# Altium schematic sheet HYDRA_V3_NAV.SchDoc
size B; SheetNumber: 1; SheetTotal: 7
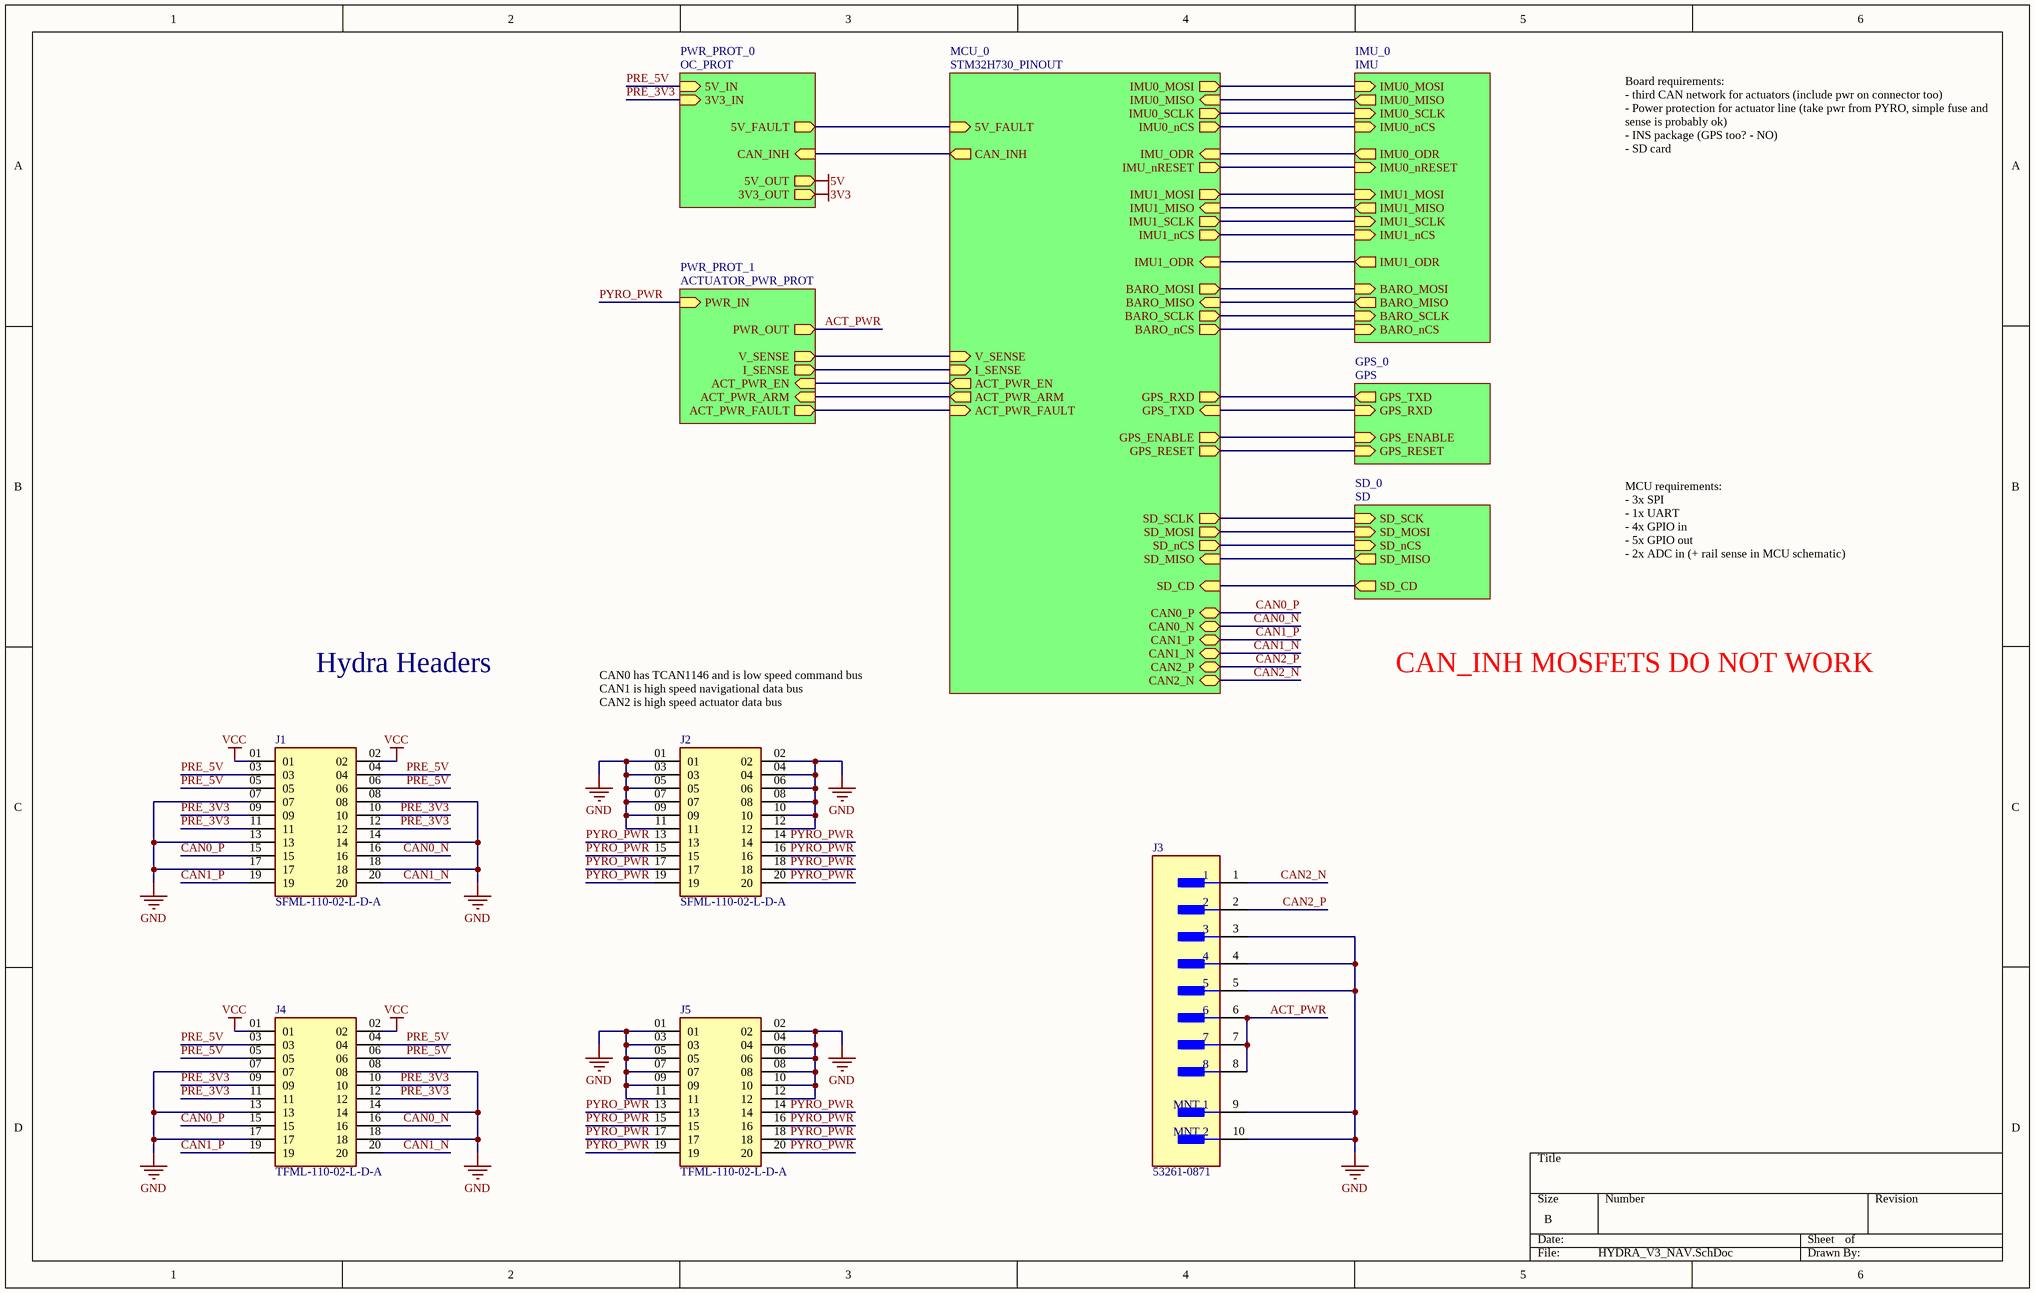
[diagram p0: HYDRA_V3_NAV.SchDoc]

## Parts
J1  SFML-110-02-L-D-A  [SFML-110-02-L-D-A-Footprint-1]
J2  SFML-110-02-L-D-A  [SFML-110-02-L-D-A-Footprint-1]
J3  53261-0871  [FP-532610871-MFG]
J4  TFML-110-02-L-D-A  [TFML-110-02-L-D-A-Footprint-1]
J5  TFML-110-02-L-D-A  [TFML-110-02-L-D-A-Footprint-1]

## Sub-sheets
GPS_0 = GPS: GPS_TXD (out), GPS_RXD (in), GPS_ENABLE (in), GPS_RESET (in)
IMU_0 = IMU: IMU0_MOSI (in), IMU0_MISO (out), IMU0_SCLK (in), IMU0_nCS (in), IMU0_ODR (out), IMU0_nRESET (in), IMU1_MOSI (in), IMU1_MISO (out), IMU1_SCLK (in), IMU1_nCS (in), IMU1_ODR (out), BARO_MOSI (in), BARO_MISO (out), BARO_SCLK (in), BARO_nCS (in)
MCU_0 = STM32H730_PINOUT: IMU_ODR (in), IMU_nRESET (out), BARO_MOSI (out), BARO_MISO (in), BARO_SCLK (out), BARO_nCS (out), V_SENSE (in), I_SENSE (in), 5V_FAULT (in), GPS_RXD (out), GPS_TXD (in), GPS_ENABLE (out), GPS_RESET (out), SD_SCLK (out), SD_MOSI (out), SD_nCS (out), SD_MISO (in), SD_CD (in), CAN0_P (bidir), CAN0_N (bidir), CAN1_P (bidir), CAN1_N (bidir), CAN2_P (bidir), CAN2_N (bidir), IMU1_MOSI (out), IMU1_MISO (in), IMU1_SCLK (out), IMU1_nCS (out), IMU1_ODR (in), CAN_INH (out), ACT_PWR_EN (out), ACT_PWR_ARM (out), ACT_PWR_FAULT (in), IMU0_MOSI (out), IMU0_MISO (in), IMU0_SCLK (out), IMU0_nCS (out)
PWR_PROT_0 = OC_PROT: 5V_OUT (out), 5V_IN (in), 3V3_IN (in), 3V3_OUT (out), 5V_FAULT (out), CAN_INH (in)
PWR_PROT_1 = ACTUATOR_PWR_PROT: PWR_IN (in), PWR_OUT (out), V_SENSE (out), I_SENSE (out), ACT_PWR_EN (in), ACT_PWR_ARM (in), ACT_PWR_FAULT (out)
SD_0 = SD: SD_SCK (in), SD_MOSI (in), SD_nCS (in), SD_MISO (out), SD_CD (out)

## Nets
3V3: sheet PWR_PROT_0/3V3_OUT
5V: sheet PWR_PROT_0/5V_OUT
GND: J1.07 J1.08 J1.13 J1.14 J1.17 J1.18 J2.01 J2.02 J2.03 J2.04 J2.05 J2.06 J2.07 J2.08 J2.09 J2.10 J2.11 J2.12 J3.3 J3.4 J3.5 J3.9(MNT_1) J3.10(MNT_2) J4.07 J4.08 J4.13 J4.14 J4.17 J4.18 J5.01 J5.02 J5.03 J5.04 J5.05 J5.06 J5.07 J5.08 J5.09 J5.10 J5.11 J5.12
VCC: J1.01 J1.02 J4.01 J4.02
ACT_PWR: J3.6 J3.7 J3.8 ; sheet PWR_PROT_1/PWR_OUT
CAN0_N: J1.16 J4.16 ; sheet MCU_0/CAN0_N
CAN0_P: J1.15 J4.15 ; sheet MCU_0/CAN0_P
CAN1_N: J1.20 J4.20 ; sheet MCU_0/CAN1_N
CAN1_P: J1.19 J4.19 ; sheet MCU_0/CAN1_P
CAN2_N: J3.1 ; sheet MCU_0/CAN2_N
CAN2_P: J3.2 ; sheet MCU_0/CAN2_P
PRE_3V3: J1.09 J1.10 J1.11 J1.12 J4.09 J4.10 J4.11 J4.12 ; sheet PWR_PROT_0/3V3_IN
PRE_5V: J1.03 J1.04 J1.05 J1.06 J4.03 J4.04 J4.05 J4.06 ; sheet PWR_PROT_0/5V_IN
PYRO_PWR: J2.13 J2.14 J2.15 J2.16 J2.17 J2.18 J2.19 J2.20 J5.13 J5.14 J5.15 J5.16 J5.17 J5.18 J5.19 J5.20 ; sheet PWR_PROT_1/PWR_IN
(unnamed): sheet MCU_0/IMU_ODR, sheet IMU_0/IMU0_ODR
(unnamed): sheet MCU_0/IMU_nRESET, sheet IMU_0/IMU0_nRESET
(unnamed): sheet MCU_0/BARO_MOSI, sheet IMU_0/BARO_MOSI
(unnamed): sheet MCU_0/BARO_MISO, sheet IMU_0/BARO_MISO
(unnamed): sheet MCU_0/BARO_SCLK, sheet IMU_0/BARO_SCLK
(unnamed): sheet MCU_0/BARO_nCS, sheet IMU_0/BARO_nCS
(unnamed): sheet MCU_0/V_SENSE, sheet PWR_PROT_1/V_SENSE
(unnamed): sheet MCU_0/I_SENSE, sheet PWR_PROT_1/I_SENSE
(unnamed): sheet MCU_0/5V_FAULT, sheet PWR_PROT_0/5V_FAULT
(unnamed): sheet MCU_0/GPS_RXD, sheet GPS_0/GPS_TXD
(unnamed): sheet MCU_0/GPS_TXD, sheet GPS_0/GPS_RXD
(unnamed): sheet MCU_0/GPS_ENABLE, sheet GPS_0/GPS_ENABLE
(unnamed): sheet MCU_0/GPS_RESET, sheet GPS_0/GPS_RESET
(unnamed): sheet MCU_0/SD_SCLK, sheet SD_0/SD_SCK
(unnamed): sheet MCU_0/SD_MOSI, sheet SD_0/SD_MOSI
(unnamed): sheet MCU_0/SD_nCS, sheet SD_0/SD_nCS
(unnamed): sheet MCU_0/SD_MISO, sheet SD_0/SD_MISO
(unnamed): sheet MCU_0/SD_CD, sheet SD_0/SD_CD
(unnamed): sheet MCU_0/IMU1_MOSI, sheet IMU_0/IMU1_MOSI
(unnamed): sheet MCU_0/IMU1_MISO, sheet IMU_0/IMU1_MISO
(unnamed): sheet MCU_0/IMU1_SCLK, sheet IMU_0/IMU1_SCLK
(unnamed): sheet MCU_0/IMU1_nCS, sheet IMU_0/IMU1_nCS
(unnamed): sheet MCU_0/IMU1_ODR, sheet IMU_0/IMU1_ODR
(unnamed): sheet MCU_0/CAN_INH, sheet PWR_PROT_0/CAN_INH
(unnamed): sheet MCU_0/ACT_PWR_EN, sheet PWR_PROT_1/ACT_PWR_EN
(unnamed): sheet MCU_0/ACT_PWR_ARM, sheet PWR_PROT_1/ACT_PWR_ARM
(unnamed): sheet MCU_0/ACT_PWR_FAULT, sheet PWR_PROT_1/ACT_PWR_FAULT
(unnamed): sheet MCU_0/IMU0_MOSI, sheet IMU_0/IMU0_MOSI
(unnamed): sheet MCU_0/IMU0_MISO, sheet IMU_0/IMU0_MISO
(unnamed): sheet MCU_0/IMU0_SCLK, sheet IMU_0/IMU0_SCLK
(unnamed): sheet MCU_0/IMU0_nCS, sheet IMU_0/IMU0_nCS

## Notes on the sheet
- Board requirements:
  - third CAN network for actuators (include pwr on connector too)
  - Power protection for actuator line (take pwr from PYRO, simple fuse and sense is probably ok)
  - INS package (GPS too? - NO)
  - SD card
- MCU requirements:
  - 3x SPI
  - 1x UART
  - 4x GPIO in
  - 5x GPIO out
  - 2x ADC in (+ rail sense in MCU schematic)
- Hydra Headers
- CAN0 has TCAN1146 and is low speed command bus
  CAN1 is high speed navigational data bus
  CAN2 is high speed actuator data bus
- CAN_INH MOSFETS DO NOT WORK

## Library data of the parts
J1 J2 = CMP-002-00043-1: Board Connector, 20 Contact(s), 2 Row(s), Female, Straight, 0.05 inch Pitch, Surface Mount Terminal, Locking, Black Insulator, Socket; RoHS Compliant: Yes; Connector Type: BOARD CONNECTOR; Mounting Technology: Board
J3 = CMP-002-00053-1: Board Connector, 8 Contact(s), 1 Row(s), Male, Right Angle, 0.049 inch Pitch, Surface Mount Terminal, Locking, Natural Insulator, Receptacle; RoHS Compliant: Yes; Max Operating Temperature: 85°C; Min Operating Temperature: -40°C; Connector Type: BOARD CONNECTOR; Mounting Technology: Board
J4 J5 = CMP-002-00042-1: Board Connector, 20 Contact(s), 2 Row(s), Male, Straight, Surface Mount Terminal; Connector Type: BOARD CONNECTOR; Mounting Technology: Board; RoHS Compliant: Yes